# Altium schematic sheet VUE_Connector.SchDoc
size A; Revision: 1.1
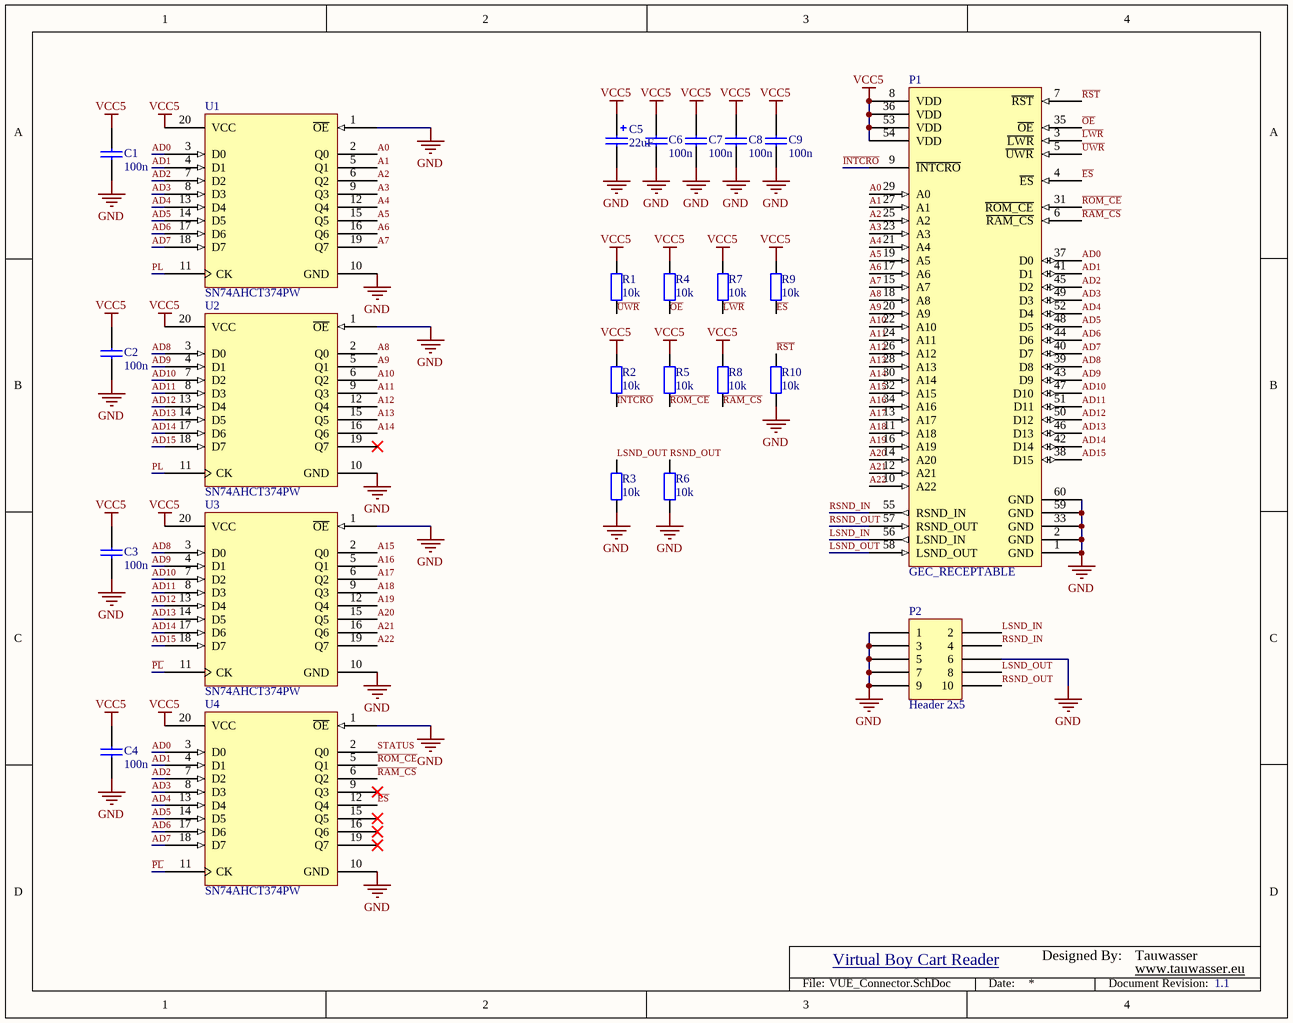
[diagram p0: VUE_Connector.SchDoc]

## Parts
C1  100n  [CAPC1608X90]
C2  100n  [CAPC1608X90]
C3  100n  [CAPC1608X90]
C4  100n  [CAPC1608X90]
C5  22uF  [CAPE66X66]
C6  100n  [CAPC1608X90]
C7  100n  [CAPC1608X90]
C8  100n  [CAPC1608X90]
C9  100n  [CAPC1608X90]
P1  GEC_RECEPTABLE  [GEC_REC]
P2  Header 2x5  [GARRY_WSL-XG-10]
R1  10k  [RESC1608X55]
R2  10k  [RESC1608X55]
R3  10k  [RESC1608X55]
R4  10k  [RESC1608X55]
R5  10k  [RESC1608X55]
R6  10k  [RESC1608X55]
R7  10k  [RESC1608X55]
R8  10k  [RESC1608X55]
R9  10k  [RESC1608X55]
R10  10k  [RESC1608X55]
U1  SN74AHCT374PW  [TSOP65P640X120-20N]
U2  SN74AHCT374PW  [TSOP65P640X120-20N]
U3  SN74AHCT374PW  [TSOP65P640X120-20N]
U4  SN74AHCT374PW  [TSOP65P640X120-20N]

## Nets
GND: C1.1 C2.1 C3.1 C4.1 C5.2 C6.1 C7.1 C8.1 C9.1 P1.1(GND) P1.2(GND) P1.33(GND) P1.59(GND) P1.60(GND) P2.1 P2.3 P2.5 P2.6 P2.7 P2.9 R3.1 R6.1 R10.1 U1.1(~{OE}) U1.10(GND) U2.1(~{OE}) U2.10(GND) U3.1(~{OE}) U3.10(GND) U4.1(~{OE}) U4.10(GND)
VCC5: C1.2 C2.2 C3.2 C4.2 C5.1 C6.2 C7.2 C8.2 C9.2 P1.8(VDD) P1.36(VDD) P1.53(VDD) P1.54(VDD) R1.2 R2.2 R4.2 R5.2 R7.2 R8.2 R9.2 U1.20(VCC) U2.20(VCC) U3.20(VCC) U4.20(VCC)
~{ES}: P1.4(~{ES}) R9.1 U4.12(Q4)
~{INTCRO}: P1.9(~{INTCRO}) R2.1
~{LWR}: P1.3(~{LWR}) R7.1
~{OE}: P1.35(~{OE}) R4.1
~{PL}: U3.11(CK) U4.11(CK)
~{RAM_CS}: P1.6(~{RAM_CS}) R8.1 U4.6(Q2)
~{ROM_CE}: P1.31(~{ROM_CE}) R5.1 U4.5(Q1)
~{RST}: P1.7(~{RST}) R10.2
~{UWR}: P1.5(~{UWR}) R1.1
A0: P1.29(A0) U1.2(Q0)
A1: P1.27(A1) U1.5(Q1)
A2: P1.25(A2) U1.6(Q2)
A3: P1.23(A3) U1.9(Q3)
A4: P1.21(A4) U1.12(Q4)
A5: P1.19(A5) U1.15(Q5)
A6: P1.17(A6) U1.16(Q6)
A7: P1.15(A7) U1.19(Q7)
A8: P1.18(A8) U2.2(Q0)
A9: P1.20(A9) U2.5(Q1)
A10: P1.22(A10) U2.6(Q2)
A11: P1.24(A11) U2.9(Q3)
A12: P1.26(A12) U2.12(Q4)
A13: P1.28(A13) U2.15(Q5)
A14: P1.30(A14) U2.16(Q6)
A15: P1.32(A15) U3.2(Q0)
A16: P1.34(A16) U3.5(Q1)
A17: P1.13(A17) U3.6(Q2)
A18: P1.11(A18) U3.9(Q3)
A19: P1.16(A19) U3.12(Q4)
A20: P1.14(A20) U3.15(Q5)
A21: P1.12(A21) U3.16(Q6)
A22: P1.10(A22) U3.19(Q7)
AD0: P1.37(D0) U1.3(D0) U4.3(D0)
AD1: P1.41(D1) U1.4(D1) U4.4(D1)
AD2: P1.45(D2) U1.7(D2) U4.7(D2)
AD3: P1.49(D3) U1.8(D3) U4.8(D3)
AD4: P1.52(D4) U1.13(D4) U4.13(D4)
AD5: P1.48(D5) U1.14(D5) U4.14(D5)
AD6: P1.44(D6) U1.17(D6) U4.17(D6)
AD7: P1.40(D7) U1.18(D7) U4.18(D7)
AD8: P1.39(D8) U2.3(D0) U3.3(D0)
AD9: P1.43(D9) U2.4(D1) U3.4(D1)
AD10: P1.47(D10) U2.7(D2) U3.7(D2)
AD11: P1.51(D11) U2.8(D3) U3.8(D3)
AD12: P1.50(D12) U2.13(D4) U3.13(D4)
AD13: P1.46(D13) U2.14(D5) U3.14(D5)
AD14: P1.42(D14) U2.17(D6) U3.17(D6)
AD15: P1.38(D15) U2.18(D7) U3.18(D7)
LSND_IN: P1.56(LSND_IN) P2.2
LSND_OUT: P1.58(LSND_OUT) P2.8 R3.2
PL: U1.11(CK) U2.11(CK)
RSND_IN: P1.55(RSND_IN) P2.4
RSND_OUT: P1.57(RSND_OUT) P2.10 R6.2
STATUS: U4.2(Q0)

Not connected (* = marked no-connect by the designer): U2 19(Q7)*; U4 9(Q3)* 15(Q5)* 16(Q6)* 19(Q7)*

## Notes on the sheet
- Virtual Boy Cart Reader
- Designed By:
- Tauwasser
- www.tauwasser.eu
- File:
- Date:
- Document Revision:

## Library data of the parts
C1-C4 C6-C9 = 1168: Ceramic Chip Capacitor; Manufacturer ID: C0603C104K5RACTU; Manufacturer: Kemet; ID: 1168; Type: Standard Ceramic; Voltage: 50V; Characteristic: X7R; Tolerance: ±10%; Value: 100n; Dielectric: Ceramic; Footprint / Size: C0603; Farnell: 1288255; Unit Price: 0; Quantity: 0; ComponentLink1Description: Website; ComponentLink1URL: http://kemet.com/; ComponentLink2Description: Datasheet; ComponentLink2URL: http://www.kemet.com/kemet/web/homepage/kechome.nsf/vapubfiles/F3102_X7R.pdf/$file/F3102_X7R.pdf
C5 = 1001: ID: 1001; Type: Electrolytic Capacitor; Designator: C?; Value: 22uF; ComponentLink1Description: Manufacturer Link; ComponentLink1URL: http://www.jamicon.com/; ComponentLink2Description: Datasheet; ComponentLink2URL: http://www.jamicon.com.tw/media/flash/CapView/assets/pdf/CT.pdf; Footprint: CAPE43X43; Pin Count: 2; Distributor 1: Reichelt; Distributor Number 1: SMD ELKO 22/35
P1 = GEC_RECEPTABLE: VUE GEC_RECEPTABLE
P2 = 2008: Shrouded Header 2x5; ID: 2008; Designator: P?; Type: Shrouded Header; Pin Count: 10; Distributor 1: Reichelt; Distributor Number 1: WSL 10G
R1-R10 = 2471: Resistor; Manufacturer ID: MC 0.063W 0603 1% 10K; Manufacturer: Multicomp; ID: 2471; Element Type: Thick Film; Tolerance: ±1%; Power rating: 0.063W; Temperatur coeff: ±100ppm/°C; Type: Standard; Value: 10k; Footprint / Size: R0603; Farnell: 9330399; Unit Price: 0; Quantity: 0; ComponentLink1Description: Website; ComponentLink2Description: Datasheet; ComponentLink2URL: http://www.farnell.com/datasheets/296742.pdf
U1-U4 = 4003: 8x D Flip Flop w/ OE_N; ID: 4003; Designator: U?; Type: FlipFlop; ComponentLink1Description: Datasheet; ComponentLink1URL: http://www.ti.com/lit/ds/symlink/sn74ahct374.pdf; Distributor 1: Farnell; Distributor Number 1: 1749807; Pin Count: 20